# EAGLE design deadlocks2 (EAGLE 8.7.1)
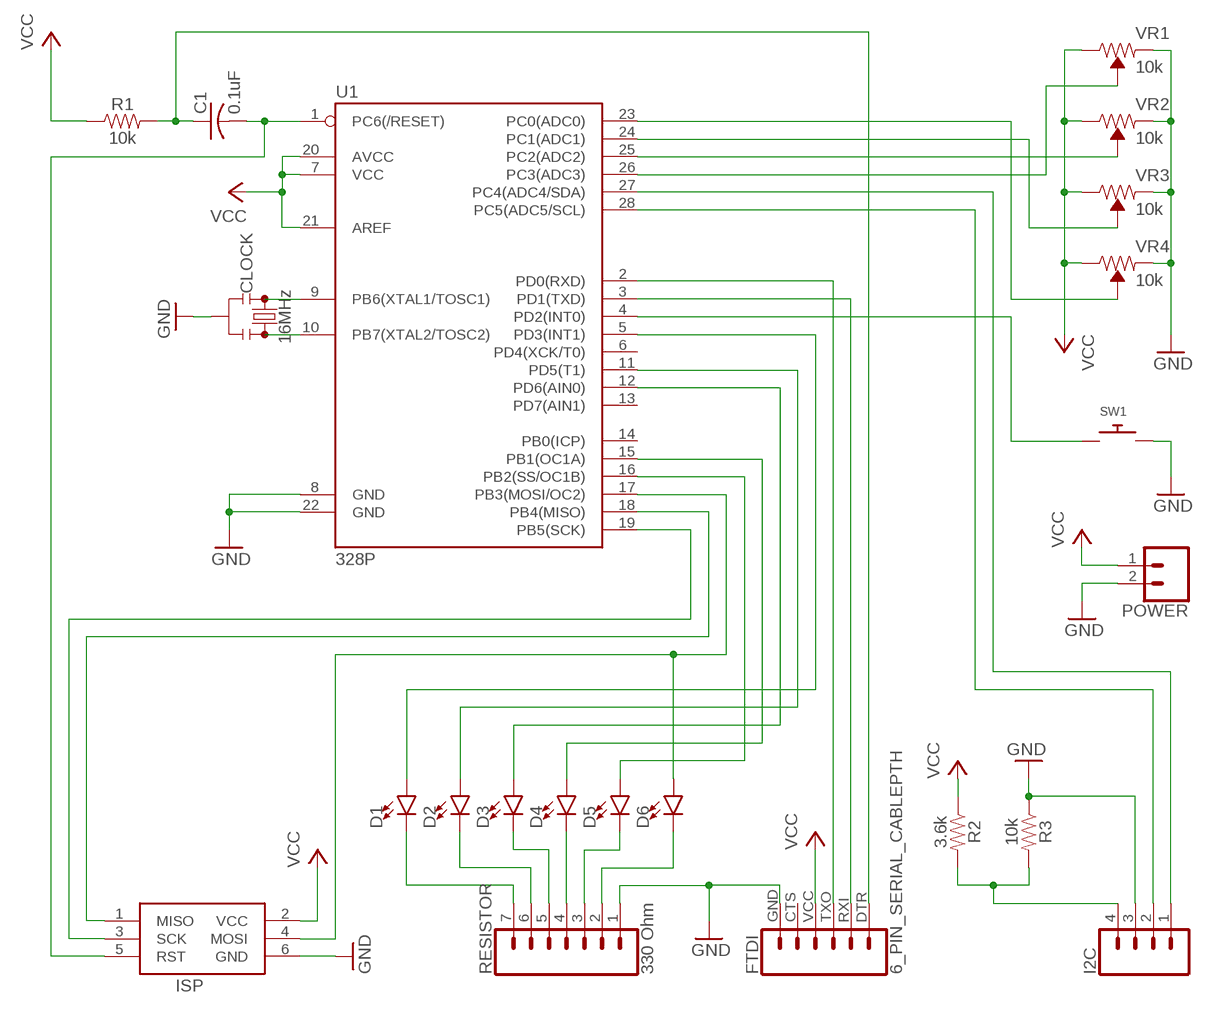
[diagram p0: schematic, sheet 1]

## Parts
C1  0.1uF  C-US025-024X044  [C025-024X044]
CLOCK  16MHz  RESONATORPTH-7.6X3.8  [RESONATOR-PTH-7.6X3.8]
D1  LED5MM  [LED_5MM]
D2  LED5MM  [LED_5MM]
D3  LED5MM  [LED_5MM]
D4  LED5MM  [LED_5MM]
D5  LED5MM  [LED_5MM]
D6  LED5MM  [LED_5MM]
FTDI  6_PIN_SERIAL_CABLEPTH  [FTDI_BASIC]
I2C  CONN_04  [1X04]
ISP  AVRISP-6  [AVRISP]
POWER  CONN_02  [1X02]
R1  10k  10KOHM-HORIZ-1/4W-1%  [AXIAL-0.3]
R2  3.6k  10KOHM-HORIZ-1/4W-1%  [AXIAL-0.3]
R3  10k  10KOHM-HORIZ-1/4W-1%  [AXIAL-0.3]
RESISTOR  330 Ohm  CONN_07  [1X07]
SW1  SWITCH_PUSHBUTTONEVQ-PE  [TACT_PANA-EVQ]
U1  328P  ATMEGA328P_PDIP  [DIP28]
VR1  10k  TRIMPOT-PTH-10MM-KNOB-1/2W-10%  [TRIMPOT-PTH-3386U]
VR2  10k  TRIMPOT-PTH-10MM-KNOB-1/2W-10%  [TRIMPOT-PTH-3386U]
VR3  10k  TRIMPOT-PTH-10MM-KNOB-1/2W-10%  [TRIMPOT-PTH-3386U]
VR4  10k  TRIMPOT-PTH-10MM-KNOB-1/2W-10%  [TRIMPOT-PTH-3386U]

## Nets
GND: CLOCK.2 FTDI.GND I2C.3 ISP.6(GND) POWER.2 R3.P$1 RESISTOR.1 SW1.P$2 U1.8(GND) U1.22(GND) VR1.1(CCW) VR2.1(CCW) VR3.1(CCW) VR4.1(CCW)
N$1: U1.26(PC3(ADC3)) VR1.2(WIPER)
N$2: CLOCK.1 U1.9(PB6(XTAL1/TOSC1))
N$3: CLOCK.3 U1.10(PB7(XTAL2/TOSC2))
N$4: U1.25(PC2(ADC2)) VR2.2(WIPER)
N$5: U1.24(PC1(ADC1)) VR3.2(WIPER)
N$6: U1.23(PC0(ADC0)) VR4.2(WIPER)
N$7: FTDI.RXI U1.3(PD1(TXD))
N$8: FTDI.TXO U1.2(PD0(RXD))
N$9: ISP.1(MISO) U1.18(PB4(MISO))
N$10: I2C.4 R2.P$2 R3.P$2
N$11: C1.2 ISP.5(RST) U1.1(PC6(/RESET))
N$12: D6.K(C) RESISTOR.2
N$13: D5.K(C) RESISTOR.3
N$14: D4.K(C) RESISTOR.4
N$15: D3.K(C) RESISTOR.5
N$16: D2.K(C) RESISTOR.6
N$17: D1.K(C) RESISTOR.7
N$18: D6.A ISP.4(MOSI) U1.17(PB3(MOSI/OC2))
N$19: D1.A U1.5(PD3(INT1))
N$20: D2.A U1.11(PD5(T1))
N$21: D3.A U1.12(PD6(AIN0))
N$22: D4.A U1.15(PB1(OC1A))
N$23: D5.A U1.16(PB2(SS/OC1B))
N$24: ISP.3(SCK) U1.19(PB5(SCK))
N$25: SW1.P$1 U1.4(PD2(INT0))
N$26: I2C.1 U1.27(PC4(ADC4/SDA))
N$27: C1.1 FTDI.DTR R1.P$2
N$28: I2C.2 U1.28(PC5(ADC5/SCL))
VCC: FTDI.VCC ISP.2(VCC) POWER.1 R1.P$1 R2.P$1 U1.7(VCC) U1.20(AVCC) U1.21(AREF) VR1.3(CW) VR2.3(CW) VR3.3(CW) VR4.3(CW)
Unconnected: FTDI.CTS U1.6(PD4(XCK/T0)) U1.13(PD7(AIN1)) U1.14(PB0(ICP))

## Library data of the parts
C1 = adafruit:C-US: CAPACITOR, American symbol
CLOCK = SparkFun-Clocks:RESONATOR: Resonators (Generic) Ceramic resonators are clock-generating components, often used to control timing in microcontrollers. They usually have 3 pins: two pins for oscillation, and one pin for ground. Compared to crystals, resonators have worse tolerance, but are usually much cheaper. Plus, they have built-in load capacitors! These devices are used on boards like the Arduino Pro 8MHz <https://www.sparkfun.com/products/11114> and Arduino Pro 16MHz <https://www.sparkfun.com/products/11113>.
D1-D6 = SparkFun-LED:LED: LED (Generic) Standard schematic elements and footprints for 5mm, 3mm, 1206, and 0603 sized LEDs. Generic LEDs with no color specified.
FTDI = SparkFun-Connectors:6_PIN_SERIAL_CABLE: 6-pin header connection for use with the "FTDI BASIC" pinout - CABLE SIDE. Also known as "Arduino Serial Program Header". This is used on a design to provide a 6-pin connection point for serial communication usually from a USB cable (D+/D-) to these headers (RX/TX). It also has the remaining pins necessary for programming in the Arduino evironment (DTR, GND, and sometimes VCC). Note, this device has "CABLE" in the name. It is intended to be used on a design that usually lives on the end of your USB cable and prvides the converter chip (FTDI232 or FTDI231x) to commnicate serial RX/TX. The "sister" device, named "TARGET" is inteneded to be used on a design that contains a target micro-controller that you wish to program. You can populate with some of these: Female Headers <https://www.sparkfun.com/products/115> (PRT-00115) For reference (or to suit your programming needs) check out these designs: SparkFun FTDI Basic Breakout - 5V <https://www.sparkfun.com/products/9716> (DEV-09716) SparkFun FTDI Basic Breakout - 3.3V <https://www.sparkfun.com/products/9873> (DEV-09873) SparkFun FTDI SmartBasic <https://www.sparkfun.com/products/12935> (DEV-12935) SparkFun Beefy 3 - FTDI Basic Breakout <https://www.sparkfun.com/products/13746> (DEV-13746)
I2C = SparkFun-Connectors:CONN_04: Multi connection point. Often used as Generic Header-pin footprint for 0.1 inch spaced/style header connections On any of the 0.1 inch spaced packages, you can populate with these: Break Away Headers - Straight <https://www.sparkfun.com/products/116> (PRT-00116) Break Away Male Headers - Right Angle <https://www.sparkfun.com/products/553> (PRT-00553) Female Headers <https://www.sparkfun.com/products/115> (PRT-00115) Break Away Headers - Machine Pin <https://www.sparkfun.com/products/117> (PRT-00117) Break Away Female Headers - Swiss Machine Pin <https://www.sparkfun.com/products/743> (PRT-00743) For SCREWTERMINALS and SPRING TERMINALS visit here: Screw Terimnals on SparkFun.com <https://www.sparkfun.com/search/results?term=Screw+Terminals> (5mm/3.5mm/2.54mm spacing) This device is also useful as a general connection point to wire up your design to another part of your project. Our various solder wires solder well into these plated through hole pads. Hook-Up Wire - Assortment (Stranded, 22 AWG) <https://www.sparkfun.com/products/11375> (PRT-11375) Hook-Up Wire - Assortment (Solid Core, 22 AWG) <https://www.sparkfun.com/products/11367> (PRT-11367) View the entire wire category on our website here <https://www.sparkfun.com/categories/141> Special notes: Molex polarized connector foot print use with SKU : PRT-08231 with associated crimp pins and housings. 1MM SMD Version SKU: PRT-10208; PROD_ID: CONN-09696
ISP = adafruit:AVRISP: AVR ISP HEADER Standard 6 pin header for AVR programming
POWER = SparkFun-Connectors:CONN_02: Multi connection point. Often used as Generic Header-pin footprint for 0.1 inch spaced/style header connections On any of the 0.1 inch spaced packages, you can populate with these: Break Away Headers - Straight <https://www.sparkfun.com/products/116> (PRT-00116) Break Away Male Headers - Right Angle <https://www.sparkfun.com/products/553> (PRT-00553) Female Headers <https://www.sparkfun.com/products/115> (PRT-00115) Break Away Headers - Machine Pin <https://www.sparkfun.com/products/117> (PRT-00117) Break Away Female Headers - Swiss Machine Pin <https://www.sparkfun.com/products/743> (PRT-00743) For SCREWTERMINALS and SPRING TERMINALS visit here: Screw Terimnals on SparkFun.com <https://www.sparkfun.com/search/results?term=Screw+Terminals> (5mm/3.5mm/2.54mm spacing) This device is also useful as a general connection point to wire up your design to another part of your project. Our various solder wires solder well into these plated through hole pads. Hook-Up Wire - Assortment (Stranded, 22 AWG) <https://www.sparkfun.com/products/11375> (PRT-11375) Hook-Up Wire - Assortment (Solid Core, 22 AWG) <https://www.sparkfun.com/products/11367> (PRT-11367) View the entire wire category on our website here <https://www.sparkfun.com/categories/141> Special notes: Molex polarized connector foot print use with: PRT-08233 with associated crimp pins and housings. 2.54_SCREWTERM for use with PRT-10571. 3.5mm Screw Terminal footprints for PRT-08084 5mm Screw Terminal footprints for use with PRT-08432
R1 R3 = SparkFun-Resistors:10KOHM: 10kΩ resistor A resistor is a passive two-terminal electrical component that implements electrical resistance as a circuit element. Resistors act to reduce current flow, and, at the same time, act to lower voltage levels within circuits. - Wikipedia; PROD_ID: RES-12183
R2 = SparkFun-Resistors:10KOHM: 10kΩ resistor A resistor is a passive two-terminal electrical component that implements electrical resistance as a circuit element. Resistors act to reduce current flow, and, at the same time, act to lower voltage levels within circuits. - Wikipedia; PROD_ID: RES-12183; VALUE: 10k
RESISTOR = SparkFun-Connectors:CONN_07: Multi connection point. Often used as Generic Header-pin footprint for 0.1 inch spaced/style header connections On any of the 0.1 inch spaced packages, you can populate with these: Break Away Headers - Straight <https://www.sparkfun.com/products/116> (PRT-00116) Break Away Male Headers - Right Angle <https://www.sparkfun.com/products/553> (PRT-00553) Female Headers <https://www.sparkfun.com/products/115> (PRT-00115) Break Away Headers - Machine Pin <https://www.sparkfun.com/products/117> (PRT-00117) Break Away Female Headers - Swiss Machine Pin <https://www.sparkfun.com/products/743> (PRT-00743) For SCREWTERMINALS and SPRING TERMINALS visit here: Screw Terimnals on SparkFun.com <https://www.sparkfun.com/search/results?term=Screw+Terminals> (5mm/3.5mm/2.54mm spacing) This device is also useful as a general connection point to wire up your design to another part of your project. Our various solder wires solder well into these plated through hole pads. Hook-Up Wire - Assortment (Stranded, 22 AWG) <https://www.sparkfun.com/products/11375> (PRT-11375) Hook-Up Wire - Assortment (Solid Core, 22 AWG) <https://www.sparkfun.com/products/11367> (PRT-11367) View the entire wire category on our website here <https://www.sparkfun.com/categories/141> Special notes: Molex polarized connector foot print use with SKU : PRT-08231 with associated crimp pins and housings. 1MM SMD Version SKU: PRT-10208 NOTES ON THE VARIANTS LOCK and LOCK_LONGPADS... This footprint was designed to help hold the alignment of a through-hole component (i.e. 6-pin header) while soldering it into place. You may notice that each hole has been shifted either up or down by 0.005 of an inch from it's more standard position (which is a perfectly straight line). This slight alteration caused the pins (the squares in the middle) to touch the edges of the holes. Because they are alternating, it causes a "brace" to hold the component in place. 0.005 has proven to be the perfect amount of "off-center" position when using our standard breakaway headers. Although looks a little odd when you look at the bare footprint, once you have a header in there, the alteration is very hard to notice. Also,if you push a header all the way into place, it is covered up entirely on the bottom side.
SW1 = adafruit:SWITCH_PUSHBUTTON: Buttons SOFTTOUCHSMD_SJ - Soft touch temporary push button (Super Junk Akihabara) Compatible with SKPMANE010 [Mouser: 688-SKPMAN] C&K_KSS = Digikey: KSS221GLFS
U1 = SparkFun-IC-Microcontroller:ATMEGA328P_PDIP: Atmel 328P Through hole ATMEGA328P uC used in the Arduino 32kb flash, 1k EEPROM, 2k SRAM Datasheet <http://www.sparkfun.com/datasheets/Components/SMD/ATMega328.pdf> SparkFun Products Storefront component: AVR 28 Pin 20MHz 32K 6A/D - ATMega328P <https://www.sparkfun.com/products/9061> (COM-09061) SparkFun Simon Says - Through-Hole Soldering Kit <https://www.sparkfun.com/products/10547> (KIT-10547) SparkFun Learn to Solder - Simon Says <https://www.sparkfun.com/products/13708> (KIT-13708) SparkFun BigTime Watch Kit <https://www.sparkfun.com/products/11734> (KIT-11734) SparkFun ClockIt <https://www.sparkfun.com/products/10930> (KIT-10930) SparkFun Serial Enabled LCD Kit <https://www.sparkfun.com/products/10097> (LCD-10097) SparkFun Simon Tilts - Through Hole Soldering Kit <https://www.sparkfun.com/products/12634> (KIT-12634) SparkFun Frequency Counter Kit <https://www.sparkfun.com/products/10140> (KIT-10140) FabFM Radio Kit <https://www.sparkfun.com/products/11043> (KIT-11043) SparkFun Binary Blaster Kit <https://www.sparkfun.com/products/12037> (KIT-12037) SparkFun Metro-Gnome <https://www.sparkfun.com/products/9236> (KIT-09236) ATmega328 with Arduino Optiboot (Uno) <https://www.sparkfun.com/products/10524> (DEV-10524); PROD_ID: IC-09136
VR1-VR4 = SparkFun-Resistors:TRIMPOT: Trimming Potentiometer (Trimpot) Three-terminal potentiometers, with an adjustable wiper and two adjustable resistors. A pot can be used to create a configurable voltage divider, or as a variable resistor. "Trimpots" are a subset of potentiometers, usually intended for "set-and-forget" applications. They're often more delicate than standard potentiometers - rated for fewer turns. Variants PTH-KNOB - PTH Trimpot w/ finger-adjustable knob Trimpot 10K with Knob <https://www.sparkfun.com/products/9806> (COM-09806) Datasheet <http://www.sparkfun.com/datasheets/Components/General/TSR-3386.pdf> SMD-3MM-CLOSED-FRAME - SMD 3mm Square Closed-Frame Trimpot Used on e.g. EasyDriver - Stepper Motor Driver <https://www.sparkfun.com/products/12779> Datasheet <http://www.bitechnologies.com/pdfs/22.pdf> (22AR10KTR) SMD-5MM - SMD 5mm Square Closed-Frame Trimpot Used on e.g. IOIO-OTG - V2.2 <https://www.sparkfun.com/products/13613> Datasheet <http://www.vishay.com/docs/51008/ts53.pdf> (TS53YL502MR10) SMD-3MM-1/10W-25% - 3mm Square Open-Frame Trimpot Used on e.g. SparkFun Shapeoko <https://www.sparkfun.com/products/13899> Datasheet <http://www.bourns.com/docs/Product-Datasheets/TC33.pdf> (TC33X-2-103E); PROD_ID: RES-09730; SF_SKU: COM-09806

## Board
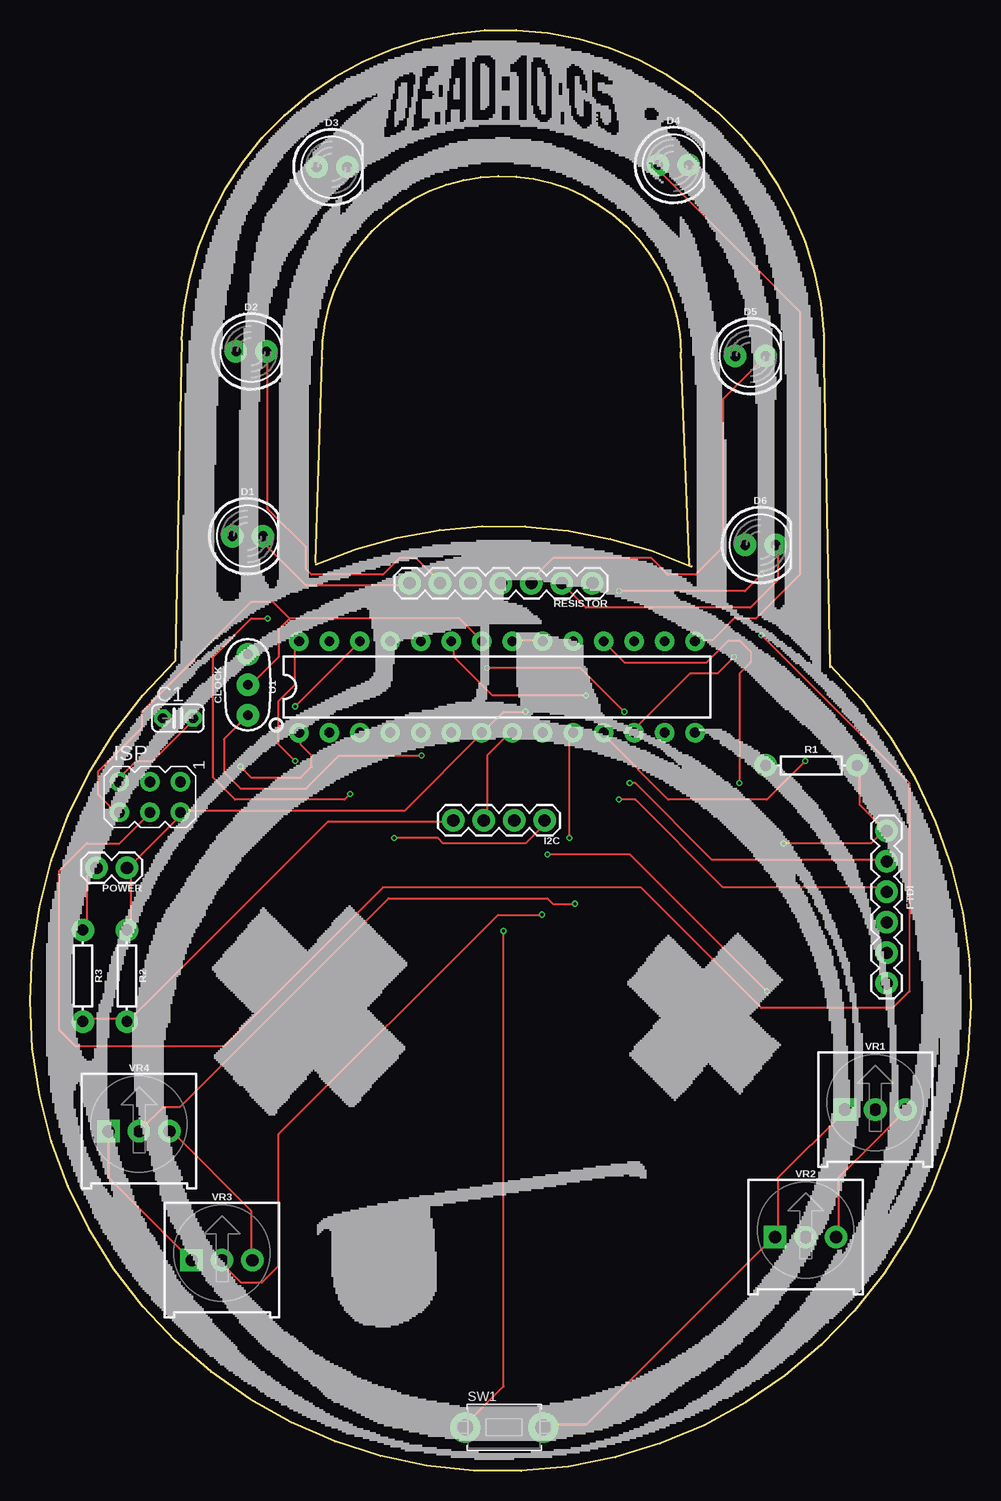
[diagram p1: board, top side]
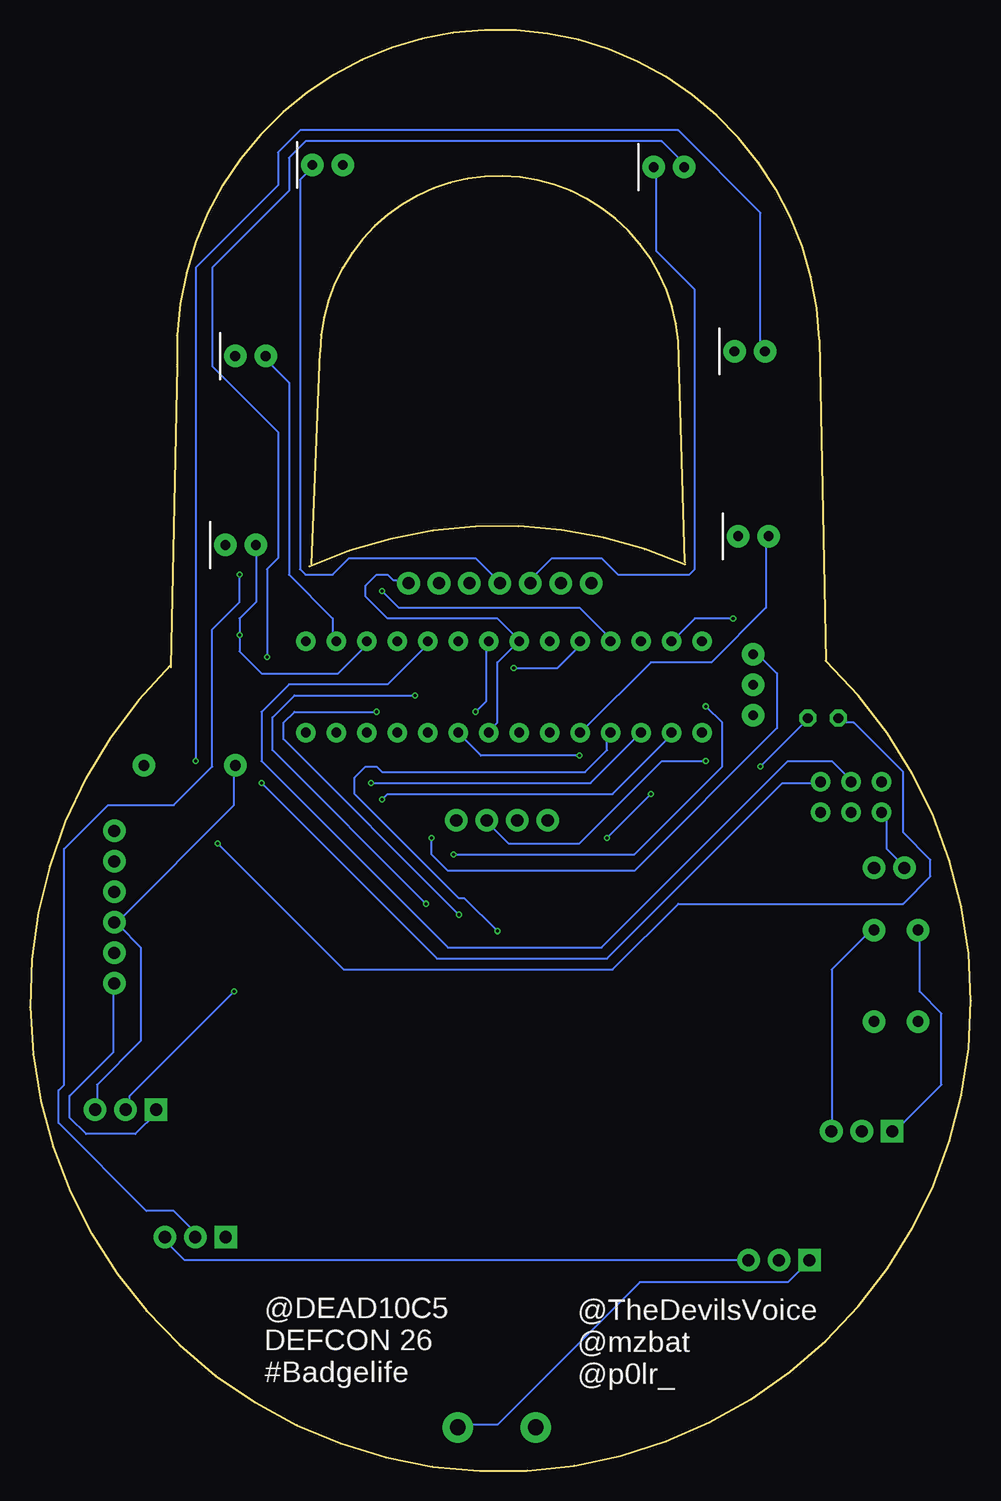
[diagram p2: board, bottom side, seen from below]

Size 78.45 x 120.12 mm. Coordinates in mm from the lower left corner, seen from the top.
Outline: 23.83,75.58 arc-47 55.16,75.41
Outline: 23.83,75.76 24.36,92.73 arc-180 54.28,93.26 54.98,75.58
Outline: 66.18,92.03 arc181 12.63,94.31 12.11,67.53 arc272 66.71,67.18
Outline: 66.18,92.21 66.71,67.01
Copper layers (1*16): Top 0.035559375mm / dielectric 1.6mm / Bottom 0.035559375mm
Design rules "oshpark-2layer": minimum track width 6mil, minimum drill 10mil, track to track 6mil, track to pad 6mil, pad to pad 6mil, via to via 6mil, smd to smd 6mil, copper to edge 15mil, drill to drill 6mil, minimum pad ring 5mil, minimum via ring 5mil, stop-mask expansion 2.5mil, vias tented up to drill 0mil, thermal gap 10mil

### Footprints (pad centres in the part's own frame; a part is rotated, then mirrored left to right if it is on the bottom)
C025-024X044 = drill 0.813 pad 1.422 octagon: 1 -1.27,0; 2 1.27,0
RESONATOR-PTH-7.6X3.8 = drill 0.8 pad 1.88: 1 -2.54,0; 2 0,0; 3 2.54,0
LED_5MM = drill 0.813 pad 1.88: A -1.27,0; K 1.27,0
FTDI_BASIC = drill 1.016 pad 1.88: CTS 10.16,0; DTR 0,0; GND 12.7,0; RXI 2.54,0; TXO 5.08,0; VCC 7.62,0
1X04 = drill 1.016 pad 1.88: 1 0,0; 2 2.54,0; 3 5.08,0; 4 7.62,0
AVRISP = drill 0.9 pad 1.626: 1 -1.27,2.54; 2 1.27,2.54; 3 -1.27,0; 4 1.27,0; 5 -1.27,-2.54; 6 1.27,-2.54
1X02 = drill 1.016 pad 1.88: 1 0,0; 2 2.54,0
AXIAL-0.3 = drill 0.9 pad 1.88: P$1 -3.81,0; P$2 3.81,0
1X07 = drill 1.016 pad 1.88: 1 0,0; 2 2.54,0; 3 5.08,0; 4 7.62,0; 5 10.16,0; 6 12.7,0; 7 15.24,0
TACT_PANA-EVQ = drill 1.3 pad 2.54: P$1 -3.25,0; P$2 3.25,0
DIP28 = drill 0.813 pad 1.626: 1 -16.51,-3.81; 2 -13.97,-3.81; 3 -11.43,-3.81; 4 -8.89,-3.81; 5 -6.35,-3.81; 6 -3.81,-3.81; 7 -1.27,-3.81; 8 1.27,-3.81; 9 3.81,-3.81; 10 6.35,-3.81; 11 8.89,-3.81; 12 11.43,-3.81; 13 13.97,-3.81; 14 16.51,-3.81; 15 16.51,3.81; 16 13.97,3.81; 17 11.43,3.81; 18 8.89,3.81; 19 6.35,3.81; 20 3.81,3.81; 21 1.27,3.81; 22 -1.27,3.81; 23 -3.81,3.81; 24 -6.35,3.81; 25 -8.89,3.81; 26 -11.43,3.81; 27 -13.97,3.81; 28 -16.51,3.81
TRIMPOT-PTH-3386U = drill 1.016 pad 1.88 square: 1 -2.54,-0.015 | drill 1.016 pad 1.88: 2 0,-0.015; 3 2.54,-0.015

### Placement (x,y rotation side)
C1  12.33,62.76 0 top
CLOCK  18.15,65.54 90 top
D1  18.15,77.93 0 top
D2  18.45,93.33 0 top
D3  25.17,108.69 0 top
D4  53.65,108.87 0 top
D5  60.07,92.94 0 top
D6  60.9,77.19 0 top
FTDI  71.43,53.36 270 top
I2C  42.91,54.23 180 top
ISP  10,56.18 270 top
POWER  8.08,50.28 180 top
R1  65.14,58.82 0 top
R2  8.08,41.28 270 top
R3  4.41,41.28 270 top
RESISTOR  46.89,74.01 180 top
SW1  39.53,3.64 0 top
U1  38.94,65.36 0 top
VR1  70.48,30.13 0 top
VR2  64.67,19.51 0 top
VR3  16.01,17.58 0 top
VR4  9.1,28.33 0 top

### Tracks (layer width: path | path; a pad name or v marks a point on that pad's centre or on a via)
GND
  Top 0.152: VR1.1 67.83,29.91 62.35,24.43 62.35,19.86 VR2.1 61.89,19.4 46.35,3.85 43.14,3.85 SW1.P$2 | R3.P$1 4.74,45.46 4.74,49.57 5.2,50.03 POWER.2 | VR4.1 6.57,28.09 6.57,24.43 13.43,17.57 VR3.1 | I2C.3 38.12,54.6 38.12,59.63 39.94,61.46 U1.8 | 21.66,71.06 20.74,70.15 20.74,67.86 18.46,65.58 CLOCK.2 | 21.66,71.06 35.83,71.06 37.66,69.23 U1.22 | 21.66,71.06 20.28,72.43 18.46,72.43 9.31,63.29 9.31,61.92 5.65,58.26 5.65,56.43 7.03,55.06 ISP.6
  Bottom 0.152: FTDI.GND 71.49,40.43 71.49,34.94 75.15,31.29 75.15,29.46 73.78,28.09 69.66,28.09 67.83,29.91 VR1.1 | ISP.6 7.03,54.6 7.03,51.86 5.65,50.49 POWER.2 | R3.P$1 4.28,45 4.28,39.97 2.45,38.14 2.45,32.2 6.11,28.54 VR4.1 | U1.8 39.94,61.92 39.49,62.38 39.49,67.4 38.12,68.78 U1.22 37.66,69.23 39.49,71.06 48.63,71.06 50.46,72.89 50.46,73.81 49.55,74.72 48.63,74.72 48.17,74.26 47.26,74.26 RESISTOR.1 | SW1.P$2 42.69,3.85 39.49,3.85 27.6,15.74 15.26,15.74 13.88,17.11 VR3.1
N$1  (via drill 0.25)
  Top 0.152: v22.11,63.75 27.14,68.78 U1.26 | v43.14,51.4 50,51.4 v61.43,39.97
  Bottom 0.152: v22.11,63.75 20.74,62.38 20.74,58.72 28.06,51.4 v43.14,51.4 | v61.43,39.97 70.12,31.29 70.12,30.37 VR1.2
N$2  (via drill 0.25)
  Top 0.152: v32.63,59.63 25.77,59.63 23.03,56.89 17.54,56.89 16.17,58.26 16.17,61 18,62.83 CLOCK.1
  Bottom 0.152: v32.63,59.63 40.86,59.63 42.69,61.46 U1.9
N$3  (via drill 0.25)
  Top 0.152: v44.97,52.77 44.97,61.46 U1.10
  Bottom 0.152: v44.97,52.77 44.97,51.4 43.6,50.03 28.06,50.03 16.17,61.92 16.17,66.49 18,68.32 CLOCK.3
N$4  (via drill 0.25)
  Top 0.152: v49.09,73.35 59.6,73.35 v60.98,74.72
  Bottom 0.152: v49.09,73.35 47.72,71.98 32.63,71.98 30.34,69.69 30.34,69.23 U1.25 | v60.98,74.72 60.98,72.43 63.26,70.15 63.26,58.72 66.46,55.52 71.95,55.52 75.61,51.86 75.61,32.2 76.06,31.74 76.06,29 68.75,21.68 66.46,21.68 64.63,19.86 VR2.2
N$5  (via drill 0.25)
  Top 0.152: v38.12,66.95 45.89,66.95 v49.55,63.29 | v42.69,46.37 39.03,46.37 20.74,28.09 20.74,17.11 19.37,15.74 17.54,15.74 16.17,17.11 VR3.2
  Bottom 0.152: v38.12,66.95 34.46,66.95 32.63,68.78 U1.24 | v49.55,63.29 56.4,63.29 57.32,62.38 57.32,61 v42.69,46.37
N$6  (via drill 0.25)
  Top 0.152: v46.35,64.66 38.57,64.66 35.37,67.86 35.37,68.78 U1.23 | v45.43,47.29 43.6,47.29 43.14,47.74 29.89,47.74 12.51,30.37 11.14,30.37 9.31,28.54 VR4.2
  Bottom 0.152: v46.35,64.66 56.4,64.66 58.23,62.83 58.23,60.09 v45.43,47.29
N$7  (via drill 0.25)
  Top 0.152: v50,57.35 50.46,57.35 56.86,50.95 71.03,50.95 FTDI.RXI
  Bottom 0.152: v50,57.35 31.71,57.35 27.6,61.46 U1.3
N$8  (via drill 0.25)
  Top 0.152: v49.09,55.97 50.46,55.97 57.78,48.66 71.03,48.66 FTDI.TXO
  Bottom 0.152: v49.09,55.97 48.63,56.43 29.89,56.43 25.31,61 25.31,61.46 U1.2
N$9  (via drill 0.25)
  Top 0.152: v59.15,57.35 59.15,66.49 60.06,67.4 60.06,68.32 59.15,69.23 58.23,69.23 56.4,67.4 49.55,67.4 48.17,68.78 U1.18
  Bottom 0.152: v59.15,57.35 44.52,42.72 30.34,42.72 15.71,57.35 12.97,57.35 ISP.1
N$10
  Top 0.152: R3.P$2 4.74,37.69 7.94,37.69 R2.P$2 8.4,37.69 24.86,54.15 34.92,54.15 I2C.4
N$11  (via drill 0.25)
  Top 0.152: C1.2 13.43,62.38 10.23,59.17 8.85,59.17 7.48,57.8 ISP.5 | v17.54,58.72 18.46,57.8 22.57,57.8 23.49,58.72 23.49,59.63 22.57,60.55 22.57,61.46 U1.1
  Bottom 0.152: v17.54,58.72 13.88,62.38 C1.2
N$12
  Top 0.152: RESISTOR.2 44.52,73.81 46.35,71.98 60.06,71.98 62.35,74.26 62.35,77.01 D6.K
N$13
  Top 0.152: RESISTOR.3 42.23,74.26 42.23,74.72 43.6,76.09 51.83,76.09 53.2,74.72 55.49,74.72 57.78,77.01 57.78,89.35 60.98,92.55 D5.K
N$14
  Bottom 0.152: RESISTOR.4 39.49,74.26 41.32,76.09 51.83,76.09 53.2,74.72 55.49,74.72 55.95,75.18 55.95,107.64 55.03,108.55 D4.K
N$15
  Bottom 0.152: D3.K 26.23,108.55 26.23,101.69 23.03,98.49 23.03,75.18 23.49,74.72 29.43,74.72 30.8,76.09 34.92,76.09 36.74,74.26 RESISTOR.5
N$16
  Top 0.152: D2.K 19.83,93.01 19.83,80.21 23.03,77.01 23.03,75.18 23.49,74.72 29.43,74.72 30.8,76.09 32.17,76.09 34,74.26 RESISTOR.6
N$17
  Top 0.152: D1.K 19.83,77.92 19.83,77.01 23.03,73.81 31.26,73.81 RESISTOR.7
N$18  (via drill 0.25)
  Top 0.152: v60.98,69.69 73.32,57.35 73.32,39.97 71.95,38.6 60.98,38.6 50.92,48.66 29.43,48.66 16.17,35.4 3.83,35.4 2.45,36.77 2.45,50.03 4.74,52.32 7.48,52.32 9.77,54.6 ISP.4
  Bottom 0.152: D6.A 59.6,77.01 59.6,72.43 60.98,71.06 v60.98,69.69 60.98,68.32 59.15,66.49 52.75,66.49 50.46,68.78 U1.17
N$19
  Bottom 0.152: U1.5 32.17,61.92 26.69,67.4 21.66,67.4 17.08,71.98 17.08,77.92 D1.A
N$20  (via drill 0.25)
  Top 0.152: v64.63,59.17 61.43,55.97 53.2,55.97 48.17,61 48.17,61.46 U1.11
  Bottom 0.152: v64.63,59.17 64.63,100.32 57.78,107.18 57.78,109.92 55.95,111.75 24.4,111.75 17.54,104.89 17.54,93.46 D2.A
N$21  (via drill 0.25)
  Top 0.152: v58.69,67.86 57.32,66.49 55.03,66.49 50.46,61.92 U1.12
  Bottom 0.152: v58.69,67.86 58.69,75.18 57.78,76.09 57.78,86.61 63.26,92.09 63.26,100.32 56.86,106.72 56.86,109.47 55.49,110.84 25.77,110.84 23.94,109.01 D3.A
N$22
  Top 0.152: U1.15 55.49,69.23 56.86,69.23 58.69,71.06 60.52,71.06 64.18,74.72 64.18,96.67 52.29,108.55 D4.A
N$23
  Bottom 0.152: U1.16 53.2,69.23 53.2,71.06 56.86,74.72 56.86,90.72 58.69,92.55 D5.A
N$24
  Bottom 0.152: ISP.3 10.23,57.8 11.6,59.17 15.26,59.17 30.8,43.63 43.6,43.63 59.15,59.17 59.15,63.29 56.86,65.58 48.63,65.58 45.43,68.78 U1.19
N$25  (via drill 0.25)
  Top 0.152: v39.49,45 39.49,7.05 36.29,3.85 SW1.P$1
  Bottom 0.152: v39.49,45 42.23,47.74 42.69,47.74 51.37,56.43 51.37,57.8 50.46,58.72 49.55,58.72 49.09,58.26 32.17,58.26 30.34,60.09 30.34,61.46 U1.4
N$26  (via drill 0.25)
  Top 0.152: v19.83,71.06 18.46,71.06 15.26,67.86 15.26,57.8 17.08,55.97 26.23,55.97 v26.69,56.43 | v30.34,52.77 34,52.77 34.46,52.32 41.32,52.32 43.14,54.15 I2C.1
  Bottom 0.152: v19.83,71.06 23.03,71.06 24.86,69.23 U1.27 | v30.34,52.77 v26.69,56.43
N$27  (via drill 0.25)
  Top 0.152: v62.8,52.32 70.12,52.32 71.03,53.23 FTDI.DTR 71.03,53.69 69.21,55.52 69.21,58.72 R1.P$2
  Bottom 0.152: v62.8,52.32 52.29,41.8 29.89,41.8 24.4,47.29 5.65,47.29 3.37,49.57 3.37,50.95 5.65,53.23 5.65,58.26 9.77,62.38 10.68,62.38 C1.1
N$28  (via drill 0.25)
  Top 0.152: v22.11,59.17 20.74,60.55 20.74,64.2 22.11,65.58 22.11,68.78 U1.28
  Bottom 0.152: v22.11,59.17 25.77,59.17 32.63,52.32 38.57,52.32 40.4,54.15 I2C.2
VCC  (via drill 0.25)
  Top 0.152: VR2.3 67.38,19.86 67.38,24.43 72.86,29.91 VR1.3 | VR3.3 18.46,17.57 18.46,21.68 12.06,28.09 VR4.3 | U1.21 40.4,69.23 42.69,69.23 U1.20 | R2.P$1 8.4,45.46 8.4,50.03 POWER.1 8.4,50.49 12.51,54.6 ISP.2 12.97,55.06 31.26,55.06 37.66,61.46 U1.7 38.12,61.92 39.49,63.29 v41.32,63.29
  Bottom 0.152: R1.P$1 61.43,58.72 61.43,55.52 71.03,45.92 FTDI.VCC 71.03,45.46 69.21,43.63 69.21,35.86 72.86,32.2 72.86,30.37 VR1.3 | v41.32,63.29 40.4,64.2 40.4,68.78 U1.21 | VR4.3 11.6,28.54 11.6,41.8 8.4,45 R2.P$1 | VR2.3 66.92,19.4 66.92,18.94 65.55,17.57 18.91,17.57 VR3.3

### Text on the board
bPlace: @TheDevilsVoice / @mzbat / @p0lr_ | @DEAD10C5 / DEFCON 26 / #Badgelife